# Altium schematic sheet MCU.SchDoc: MCU
size A4; DocumentNumber: MB1136; Revision: C.3; SheetNumber: 2; SheetTotal: 4; Project: NUCLEO-XXXXRX
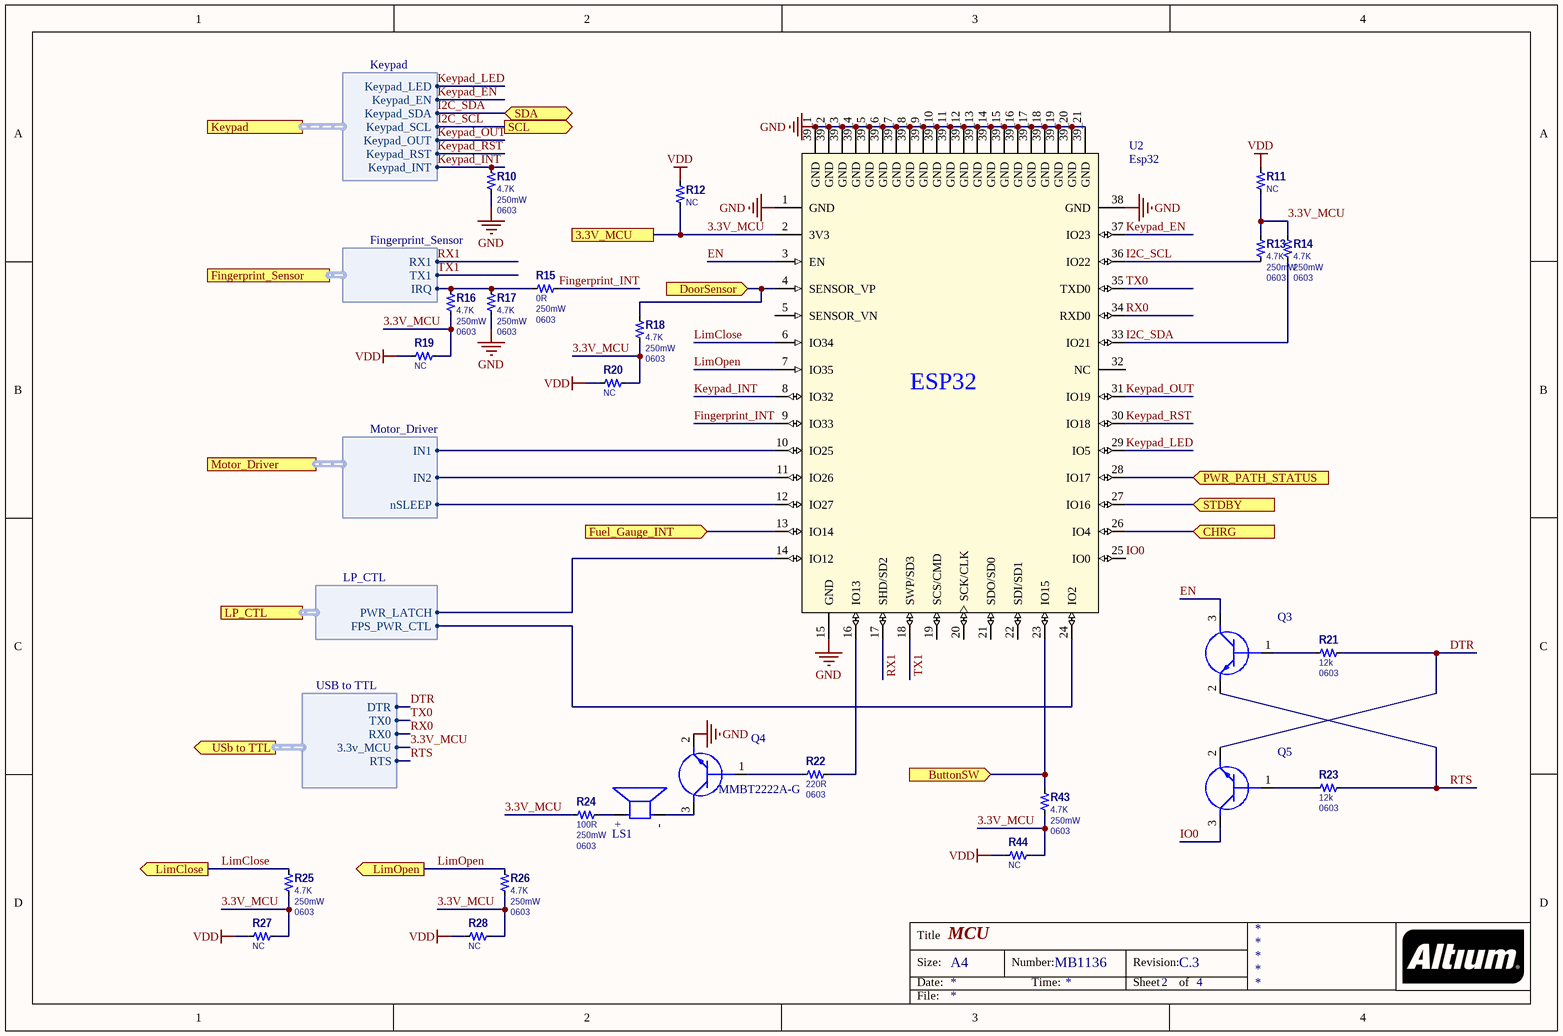
[diagram p0: MCU.SchDoc]

## Parts
LS1  AI-1223-TWT-3V-2-R  [XDCR_AI-1223-TWT-3V-2-R]  (value not drawn)
Q3  MMBT2222A-G  [SOT95P240X115-3N]  (value not drawn)
Q4  MMBT2222A-G  [SOT95P240X115-3N]
Q5  MMBT2222A-G  [SOT95P240X115-3N]  (value not drawn)
R10  4.7K  Power Rating: 250mW  Case/Package: 0603  [0603-R]
R11  NC  [0603-R]
R12  NC  [0603-R]
R13  4.7K  Power Rating: 250mW  Case/Package: 0603  [0603-R]
R14  4.7K  Power Rating: 250mW  Case/Package: 0603  [0603-R]
R15  0R  Power Rating: 250mW  Case/Package: 0603  [0603-R]
R16  4.7K  Power Rating: 250mW  Case/Package: 0603  [0603-R]
R17  4.7K  Power Rating: 250mW  Case/Package: 0603  [0603-R]
R18  4.7K  Power Rating: 250mW  Case/Package: 0603  [0603-R]
R19  NC  [0603-R]
R20  NC  [0603-R]
R21  12k  Case/Package: 0603  [0603-R]
R22  220R  Case/Package: 0603  [0603-R]
R23  12k  Case/Package: 0603  [0603-R]
R24  100R  Power Rating: 250mW  Case/Package: 0603  [0603-R]
R25  4.7K  Power Rating: 250mW  Case/Package: 0603  [0603-R]
R26  4.7K  Power Rating: 250mW  Case/Package: 0603  [0603-R]
R27  NC  [0603-R]
R28  NC  [0603-R]
R43  4.7K  Power Rating: 250mW  Case/Package: 0603  [0603-R]
R44  NC  [0603-R]
U2  Esp32  [MODULE_ESP32-WROOM-32]

## Ports
3.3V_MCU, ButtonSW (in), CHRG (in), DoorSensor (in), Fingerprint_Sensor (harness Fingerprint_Sensor), Fuel_Gauge_INT (in), Keypad (harness Keypad), LimClose (out), LimOpen (out), LP_CTL (harness LP_CTL), Motor_Driver (harness Motor_Driver), PWR_PATH_STATUS (in), SCL (out), SDA (bidir), STDBY (in), USb to TTL (out, harness USB to TTL)

## Harnesses
Keypad: Keypad_RST, Keypad_EN, Keypad_SDA, Keypad_SCL, Keypad_OUT, Keypad_INT, Keypad_LED
Fingerprint_Sensor: RX1, TX1, IRQ
Motor_Driver: IN1, IN2, nSLEEP
LP_CTL: PWR_LATCH, FPS_PWR_CTL
USB to TTL: TX0, RX0, DTR, RTS, 3.3v_MCU

## Nets
GND: Q4.2(E) R10.2 R17.2 U2.1(GND) U2.15(GND) U2.38(GND) U2.39_1(GND) U2.39_2(GND) U2.39_3(GND) U2.39_4(GND) U2.39_5(GND) U2.39_6(GND) U2.39_7(GND) U2.39_8(GND) U2.39_9(GND) U2.39_10(GND) U2.39_11(GND) U2.39_12(GND) U2.39_13(GND) U2.39_14(GND) U2.39_15(GND) U2.39_16(GND) U2.39_17(GND) U2.39_18(GND) U2.39_19(GND) U2.39_20(GND) U2.39_21(GND)
VDD: R11.2 R12.2 R19.1 R20.1 R27.1 R28.1 R44.1
3.3V_MCU: R11.1 R12.1 R13.1 R14.1 R16.2 R18.2 R19.2 R20.2 R24.1 R25.2 R26.2 R27.2 R28.2 R43.2 R44.2 U2.2(3V3) ; port 3.3V_MCU, port USb to TTL.3.3v_MCU
ButtonSW: R43.1 U2.23(IO15) ; port ButtonSW
CHRG: U2.26(IO4) ; port CHRG
DoorSensor: R18.1 U2.4(SENSOR_VP) ; port DoorSensor
DTR: Q5.2(E) R21.1 ; port USb to TTL.DTR
EN: Q3.3(C) U2.3(EN)
Fingerprint_INT: R15.2 U2.9(IO33)
Fuel_Gauge_INT: U2.13(IO14) ; port Fuel_Gauge_INT
I2C_SCL: R13.2 U2.36(IO22) ; port SCL, port Keypad.Keypad_SCL
I2C_SDA: R14.2 U2.33(IO21) ; port SDA, port Keypad.Keypad_SDA
IO0: Q5.3(C) U2.25(IO0)
Keypad_EN: U2.37(IO23) ; port Keypad.Keypad_EN
Keypad_INT: R10.1 U2.8(IO32) ; port Keypad.Keypad_INT
Keypad_LED: U2.29(IO5) ; port Keypad.Keypad_LED
Keypad_OUT: U2.31(IO19) ; port Keypad.Keypad_OUT
Keypad_RST: U2.30(IO18) ; port Keypad.Keypad_RST
LimClose: R25.1 U2.6(IO34) ; port LimClose
LimOpen: R26.1 U2.7(IO35) ; port LimOpen
PWR_PATH_STATUS: U2.28(IO17) ; port PWR_PATH_STATUS
RTS: Q3.2(E) R23.1 ; port USb to TTL.RTS
RX0: U2.34(RXD0) ; port USb to TTL.RX0
RX1: U2.17(SHD/SD2) ; port Fingerprint_Sensor.RX1
STDBY: U2.27(IO16) ; port STDBY
TX0: U2.35(TXD0) ; port USb to TTL.TX0
TX1: U2.18(SWP/SD3) ; port Fingerprint_Sensor.TX1
NetLS1_N: LS1.N Q4.3(C)
NetLS1_P: LS1.P R24.2
NetQ3_1: Q3.1(B) R21.2
NetQ4_1: Q4.1(B) R22.2
NetQ5_1: Q5.1(B) R23.2
NetR15_1: R15.1 R16.1 R17.1 ; port Fingerprint_Sensor.IRQ
NetR22_1: R22.1 U2.16(IO13)
NetU2_10: U2.10(IO25) ; port Motor_Driver.IN1
NetU2_11: U2.11(IO26) ; port Motor_Driver.IN2
NetU2_12: U2.12(IO27) ; port Motor_Driver.nSLEEP
NetU2_14: U2.14(IO12) ; port LP_CTL.PWR_LATCH
NetU2_24: U2.24(IO2) ; port LP_CTL.FPS_PWR_CTL

Not connected (* = marked no-connect by the designer): U2 5(SENSOR_VN) 19(SCS/CMD) 20(SCK/CLK) 21(SDO/SD0) 22(SDI/SD1) 32(NC)

## Notes on the sheet
- Title
- Size:
- Date:
- A4
- Number:
- Time:
- Revision:
- Sheet
- of
- File:
- (in symbol AI-1223-TWT-3V-2-R) +; -
- (in symbol ESP32-WROOM-32) ESP32

## Library data of the parts
LS1 = AI-1223-TWT-3V-2-R: AUDIO INDICATOR 82 DB 3 VDC 2300 HZ; MF: PUI Audio,; SnapEDA_Link: https://www.snapeda.com/parts/AI-1223-TWT-3V-2-R/PUI%20Audio,%20Inc./view-part/548758/?ref=snap; Availability: In Stock; Price: None; Purchase-URL: https://pricing.snapeda.com/search/part/AI-1223-TWT-3V-2-R/?ref=eda; Check_prices: https://www.snapeda.com/parts/AI-1223-TWT-3V-2-R/PUI%20Audio,%20Inc./view-part/548758/?ref=eda; Package: None; MP: AI-1223-TWT-3V-2-R; Value: *
Q3 = MMBT2222A-G_Mirror: Transistor BJT NPN; Manufacturer_Name: Comchip Technology; Datasheet Link: http://www.comchiptech.com/admin/files/product/MMBT2222A-G%20RevB.pdf; Height: 1.15mm; Manufacturer_Part_Number: MMBT2222A-G; Mouser Part Number: 750-MMBT2222A-G; Mouser Price/Stock: https://www.mouser.co.uk/ProductDetail/Comchip-Technology/MMBT2222A-G?qs=2qJf6qQ4IOIM%2FSE9iCL8gQ%3D%3D; Arrow Part Number: MMBT2222A-G; Arrow Price/Stock: https://www.arrow.com/en/products/mmbt2222a-g/comchip-technology
Q4 Q5 = MMBT2222A-G: Transistor BJT NPN; Manufacturer_Name: Comchip Technology; Datasheet Link: http://www.comchiptech.com/admin/files/product/MMBT2222A-G%20RevB.pdf; Height: 1.15mm; Manufacturer_Part_Number: MMBT2222A-G; Mouser Part Number: 750-MMBT2222A-G; Mouser Price/Stock: https://www.mouser.co.uk/ProductDetail/Comchip-Technology/MMBT2222A-G?qs=2qJf6qQ4IOIM%2FSE9iCL8gQ%3D%3D; Arrow Part Number: MMBT2222A-G; Arrow Price/Stock: https://www.arrow.com/en/products/mmbt2222a-g/comchip-technology
R10 R13-R18 R24-R26 R43 = Res: Manufacturer: Panasonic; Manufacturer Part Number: ERJ-8GEYJ621V; Resistance: 620R; Tolerance: 5%; Voltage Rating: 200V; Temperature Coefficient: 200ppm/°C; ComponentLink1URL: https://datasheet.ciiva.com/15193/getdatasheetpartid-366470-15193725.pdf?src-supplier=Verical; ComponentLink1Description: Datasheet; Supplier 1: Avnet; Stock 1: 6255; Pricing 1: 1 = 0.01200 (USD); RoHS: Yes; Mount: Surface Mount; Case Code (Metric): 3216; Case Code (Imperial): 1206; Contact Plating: Tin; Min Operating Temperature: -55°C; Max Operating Temperature: 155°C; Packaging: Tape and Reel; Package Quantity: 1; Resistor Type: Thick Film; Number of Terminations: 2; Max Power Dissipation: 250mW; Voltage Rating (DC): 200V; Features: Automotive AEC-Q200; Series: ERJ; Construction: Rectangular; Resistance Tolerance: 5%; Length: 3.2mm; Width: 0.063inch; Height: 0.028inch; Depth: 1.6mm; Radiation Hardening: No; REACH SVHC: No SVHC; Military Standard: Not; Lead Free: Lead Free; RoHS Compliant: Yes; ComponentLink2URL: https://datasheet.ciiva.com/46387/1500035-46387094.pdf?src-supplier=Element14; ComponentLink2Description: https://datasheet.ciiva.com/46387/1500035-46387094.pdf?src-supplier=Element14; ComponentLink3URL: https://datasheet.ciiva.com/5915/1500035-5915369.pdf?src-supplier=Farnell; ComponentLink3Description: https://datasheet.ciiva.com/5915/1500035-5915369.pdf?src-supplier=Farnell; ComponentLink4URL: https://datasheet.ciiva.com/28677/1678796-28677018.pdf?src-supplier=Element14; ComponentLink4Description: https://datasheet.ciiva.com/28677/1678796-28677018.pdf?src-supplier=Element14; ComponentLink5URL: https://datasheet.ciiva.com/17204/aoa0000ce1-17204972.pdf?src-supplier=Avnet+Europe; ComponentLink5Description: https://datasheet.ciiva.com/17204/aoa0000ce1-17204972.pdf?src-supplier=Avnet+Europe; ComponentLink6URL: https://datasheet.ciiva.com/16515/aoa0000ce1-16515933.pdf?src-supplier=Avnet+Asia; ComponentLink6Description: https://datasheet.ciiva.com/16515/aoa0000ce1-16515933.pdf?src-supplier=Avnet+Asia; Supplier Part Number 1: 65T8955
R11 R12 R19-R23 R27 R28 R44 = Res: Manufacturer: Panasonic; Manufacturer Part Number: ERJ-8GEYJ621V; Resistance: 620R; Tolerance: 5%; Voltage Rating: 200V; Temperature Coefficient: 200ppm/°C; Max Power Dissipation: 250mW; ComponentLink1URL: https://datasheet.ciiva.com/15193/getdatasheetpartid-366470-15193725.pdf?src-supplier=Verical; ComponentLink1Description: Datasheet; Supplier 1: Avnet; Stock 1: 6255; Pricing 1: 1 = 0.01200 (USD); RoHS: Yes; Mount: Surface Mount; Case Code (Metric): 3216; Case Code (Imperial): 1206; Contact Plating: Tin; Min Operating Temperature: -55°C; Max Operating Temperature: 155°C; Packaging: Tape and Reel; Package Quantity: 1; Resistor Type: Thick Film; Number of Terminations: 2; Voltage Rating (DC): 200V; Features: Automotive AEC-Q200; Series: ERJ; Construction: Rectangular; Resistance Tolerance: 5%; Length: 3.2mm; Width: 0.063inch; Height: 0.028inch; Depth: 1.6mm; Radiation Hardening: No; REACH SVHC: No SVHC; Military Standard: Not; Lead Free: Lead Free; RoHS Compliant: Yes; ComponentLink2URL: https://datasheet.ciiva.com/46387/1500035-46387094.pdf?src-supplier=Element14; ComponentLink2Description: https://datasheet.ciiva.com/46387/1500035-46387094.pdf?src-supplier=Element14; ComponentLink3URL: https://datasheet.ciiva.com/5915/1500035-5915369.pdf?src-supplier=Farnell; ComponentLink3Description: https://datasheet.ciiva.com/5915/1500035-5915369.pdf?src-supplier=Farnell; ComponentLink4URL: https://datasheet.ciiva.com/28677/1678796-28677018.pdf?src-supplier=Element14; ComponentLink4Description: https://datasheet.ciiva.com/28677/1678796-28677018.pdf?src-supplier=Element14; ComponentLink5URL: https://datasheet.ciiva.com/17204/aoa0000ce1-17204972.pdf?src-supplier=Avnet+Europe; ComponentLink5Description: https://datasheet.ciiva.com/17204/aoa0000ce1-17204972.pdf?src-supplier=Avnet+Europe; ComponentLink6URL: https://datasheet.ciiva.com/16515/aoa0000ce1-16515933.pdf?src-supplier=Avnet+Asia; ComponentLink6Description: https://datasheet.ciiva.com/16515/aoa0000ce1-16515933.pdf?src-supplier=Avnet+Asia; Supplier Part Number 1: 65T8955; Power Rating: 250mW
  R11 R12 R19 R20 R27 R28 R44: Case/Package: 0603
U2 = ESP32-WROOM-32: Bluetooth, WiFi Transceiver Module 2.4GHz ~ 2.5GHz Surface Mount; MF: Espressif Systems; Package: Module Espressif Systems; Digi-Key_Part_Number: 1904-1010-1-ND; Digi-Key_Purchase_URL: https://www.digikey.com/product-detail/en/espressif-systems/ESP32-WROOM-32/1904-1010-1-ND/8544305?utm_source=snapeda&utm_medium=aggregator&utm_campaign=symbol; Value: *; MP: ESP32-WROOM-32; SnapEDA_Link: https://www.snapeda.com/parts/ESP32-WROOM-32/Espressif%20Systems/view-part/2753322/?ref=snap